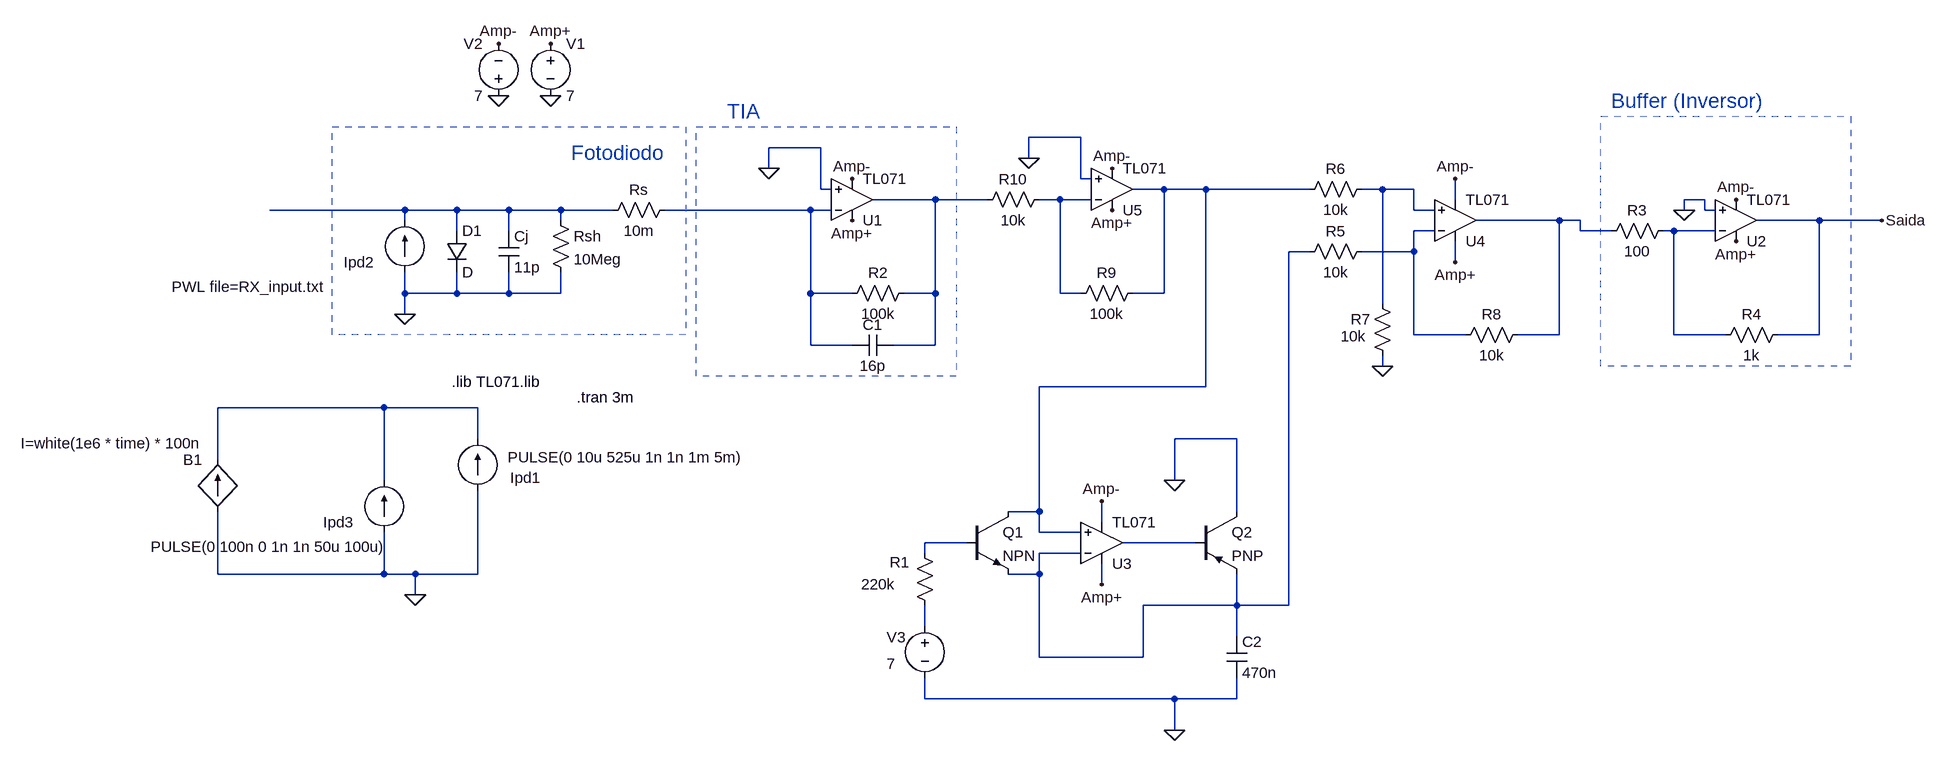
[diagram p0: schematic adaptative_receptor.asc]
adaptative_receptor.asc, the LTspice schematic file:
Version 4
SHEET 1 1100 900
WIRE -1440 -80 -1520 -80
WIRE -1840 -64 -1920 -64
WIRE -1520 -48 -1520 -80
WIRE -1920 -32 -1920 -64
WIRE -1440 -16 -1440 -80
WIRE -1424 -16 -1440 -16
WIRE -1840 0 -1840 -64
WIRE -1824 0 -1840 0
WIRE -1312 0 -1360 0
WIRE -1248 0 -1312 0
WIRE -1088 0 -1248 0
WIRE -976 0 -1008 0
WIRE -928 0 -976 0
WIRE -1664 16 -1760 16
WIRE -1584 16 -1664 16
WIRE -1472 16 -1504 16
WIRE -1424 16 -1472 16
WIRE -864 16 -864 -16
WIRE -480 16 -512 16
WIRE -2480 32 -2688 32
WIRE -2400 32 -2480 32
WIRE -2320 32 -2400 32
WIRE -2240 32 -2320 32
WIRE -2160 32 -2240 32
WIRE -1856 32 -2080 32
WIRE -1824 32 -1856 32
WIRE -928 32 -928 0
WIRE -896 32 -928 32
WIRE -512 32 -512 16
WIRE -480 32 -480 16
WIRE -464 32 -480 32
WIRE -2480 48 -2480 32
WIRE -2240 48 -2240 32
WIRE -704 48 -832 48
WIRE -672 48 -704 48
WIRE -304 48 -400 48
WIRE -208 48 -304 48
WIRE -2400 64 -2400 32
WIRE -2320 64 -2320 32
WIRE -896 64 -928 64
WIRE -672 64 -672 48
WIRE -624 64 -672 64
WIRE -528 64 -544 64
WIRE -464 64 -528 64
WIRE -1088 96 -1120 96
WIRE -928 96 -928 64
WIRE -928 96 -1008 96
WIRE -864 112 -864 80
WIRE -2480 160 -2480 128
WIRE -2400 160 -2400 128
WIRE -2400 160 -2480 160
WIRE -2320 160 -2320 128
WIRE -2320 160 -2400 160
WIRE -2240 160 -2240 128
WIRE -2240 160 -2320 160
WIRE -1856 160 -1856 32
WIRE -1792 160 -1856 160
WIRE -1664 160 -1664 16
WIRE -1664 160 -1712 160
WIRE -1472 160 -1472 16
WIRE -1440 160 -1472 160
WIRE -1312 160 -1312 0
WIRE -1312 160 -1360 160
WIRE -976 176 -976 0
WIRE -2480 192 -2480 160
WIRE -928 224 -928 96
WIRE -848 224 -928 224
WIRE -704 224 -704 48
WIRE -704 224 -768 224
WIRE -528 224 -528 64
WIRE -448 224 -528 224
WIRE -304 224 -304 48
WIRE -304 224 -368 224
WIRE -1856 240 -1856 160
WIRE -1792 240 -1856 240
WIRE -1664 240 -1664 160
WIRE -1664 240 -1728 240
WIRE -976 272 -976 256
WIRE -1248 304 -1248 0
WIRE -1248 304 -1504 304
WIRE -2512 336 -2768 336
WIRE -2368 336 -2512 336
WIRE -2368 384 -2368 336
WIRE -1200 384 -1296 384
WIRE -2768 416 -2768 336
WIRE -2512 448 -2512 336
WIRE -1296 448 -1296 384
WIRE -1504 496 -1504 304
WIRE -1504 496 -1552 496
WIRE -1200 496 -1200 384
WIRE -1408 512 -1408 480
WIRE -1504 528 -1504 496
WIRE -1440 528 -1504 528
WIRE -1616 544 -1680 544
WIRE -1264 544 -1376 544
WIRE -1680 560 -1680 544
WIRE -1440 560 -1504 560
WIRE -2768 592 -2768 496
WIRE -2512 592 -2512 528
WIRE -2512 592 -2768 592
WIRE -2464 592 -2512 592
WIRE -2368 592 -2368 464
WIRE -2368 592 -2464 592
WIRE -1504 592 -1504 560
WIRE -1504 592 -1552 592
WIRE -1408 608 -1408 576
WIRE -2464 624 -2464 592
WIRE -1200 640 -1200 592
WIRE -1200 640 -1344 640
WIRE -1120 640 -1120 96
WIRE -1120 640 -1200 640
WIRE -1680 672 -1680 640
WIRE -1200 688 -1200 640
WIRE -1504 720 -1504 592
WIRE -1344 720 -1344 640
WIRE -1344 720 -1504 720
WIRE -1680 784 -1680 752
WIRE -1296 784 -1680 784
WIRE -1200 784 -1200 752
WIRE -1200 784 -1296 784
WIRE -1296 832 -1296 784
FLAG -2256 -224 Amp+
FLAG -2256 -144 0
FLAG -2336 -224 Amp-
FLAG -2336 -144 0
FLAG -1792 48 Amp+
FLAG -1792 -16 Amp-
FLAG -1920 -32 0
FLAG -432 80 Amp+
FLAG -432 16 Amp-
FLAG -512 32 0
FLAG -2480 192 0
FLAG -1408 480 Amp-
FLAG -864 -16 Amp-
FLAG -1408 608 Amp+
FLAG -864 112 Amp+
FLAG -976 272 0
FLAG -1296 832 0
FLAG -1296 448 0
FLAG -2464 624 0
FLAG -208 48 Saida
FLAG -1392 32 Amp+
FLAG -1392 -32 Amp-
FLAG -1520 -48 0
SYMBOL OpAmps\\opamp2 -1792 80 M180
SYMATTR InstName U1
SYMATTR Value TL071
SYMBOL voltage -2256 -240 R0
WINDOW 123 0 0 Left 0
WINDOW 39 0 0 Left 0
SYMATTR InstName V1
SYMATTR Value 7
SYMBOL voltage -2336 -128 R180
WINDOW 0 24 96 Left 2
WINDOW 3 24 16 Left 2
WINDOW 123 0 0 Left 0
WINDOW 39 0 0 Left 0
SYMATTR InstName V2
SYMATTR Value 7
SYMBOL res -1696 144 R90
WINDOW 0 0 56 VBottom 2
WINDOW 3 32 56 VTop 2
SYMATTR InstName R2
SYMATTR Value 100k
SYMBOL res -528 48 R90
WINDOW 0 0 56 VBottom 2
WINDOW 3 32 56 VTop 2
SYMATTR InstName R3
SYMATTR Value 100
SYMBOL OpAmps\\opamp2 -432 112 M180
SYMATTR InstName U2
SYMATTR Value TL071
SYMBOL res -464 240 R270
WINDOW 0 32 56 VTop 2
WINDOW 3 0 56 VBottom 2
SYMATTR InstName R4
SYMATTR Value 1k
SYMBOL diode -2416 64 R0
SYMATTR InstName D1
SYMBOL cap -2336 64 R0
SYMATTR InstName Cj
SYMATTR Value 11p
SYMBOL res -2256 32 R0
SYMATTR InstName Rsh
SYMATTR Value 10Meg
SYMBOL res -2064 16 R90
WINDOW 0 0 56 VBottom 2
WINDOW 3 32 56 VTop 2
SYMATTR InstName Rs
SYMATTR Value 10m
SYMBOL cap -1728 224 R90
WINDOW 0 0 32 VBottom 2
WINDOW 3 32 32 VTop 2
SYMATTR InstName C1
SYMATTR Value 16p
SYMBOL npn -1616 496 R0
SYMATTR InstName Q1
SYMBOL pnp -1264 496 R0
SYMATTR InstName Q2
SYMBOL OpAmps\\opamp2 -1408 608 M180
SYMATTR InstName U3
SYMATTR Value TL071
SYMBOL cap -1216 688 R0
SYMATTR InstName C2
SYMATTR Value 470n
SYMBOL res -1696 544 R0
WINDOW 0 -38 30 Left 2
WINDOW 3 -82 64 Left 2
SYMATTR InstName R1
SYMATTR Value 220k
SYMBOL voltage -1680 656 R0
WINDOW 0 -59 33 Left 2
WINDOW 3 -59 74 Left 2
WINDOW 123 0 0 Left 0
WINDOW 39 0 0 Left 0
SYMATTR InstName V3
SYMATTR Value 7
SYMBOL OpAmps\\opamp2 -864 112 M180
SYMATTR InstName U4
SYMATTR Value TL071
SYMBOL res -1104 112 R270
WINDOW 0 32 56 VTop 2
WINDOW 3 0 56 VBottom 2
SYMATTR InstName R5
SYMATTR Value 10k
SYMBOL res -1104 16 R270
WINDOW 0 32 56 VTop 2
WINDOW 3 0 56 VBottom 2
SYMATTR InstName R6
SYMATTR Value 10k
SYMBOL res -992 160 R0
WINDOW 0 -33 40 Left 2
WINDOW 3 -48 66 Left 2
SYMATTR InstName R7
SYMATTR Value 10k
SYMBOL res -752 208 R90
WINDOW 0 0 56 VBottom 2
WINDOW 3 32 56 VTop 2
SYMATTR InstName R8
SYMATTR Value 10k
SYMBOL current -2512 528 R180
WINDOW 3 359 -22 Right 2
WINDOW 123 0 0 Left 0
WINDOW 39 0 0 Left 0
WINDOW 0 94 16 Right 2
SYMATTR Value PULSE(0 100n 0 1n 1n 50u 100u)
SYMATTR InstName Ipd3
SYMBOL current -2368 464 R180
WINDOW 3 -46 52 Right 2
WINDOW 123 0 0 Left 0
WINDOW 39 0 0 Left 0
WINDOW 0 -50 20 Right 2
SYMATTR Value PULSE(0 10u 525u 1n 1n 1m 5m)
SYMATTR InstName Ipd1
SYMBOL bi -2768 496 R180
WINDOW 0 24 80 Left 2
WINDOW 3 24 105 Left 2
SYMATTR InstName B1
SYMATTR Value I=white(1e6 * time) * 100n
SYMBOL OpAmps\\opamp2 -1392 64 M180
SYMATTR InstName U5
SYMATTR Value TL071
SYMBOL res -1344 144 R90
WINDOW 0 0 56 VBottom 2
WINDOW 3 32 56 VTop 2
SYMATTR InstName R9
SYMATTR Value 100k
SYMBOL res -1488 0 R90
WINDOW 0 0 56 VBottom 2
WINDOW 3 32 56 VTop 2
SYMATTR InstName R10
SYMATTR Value 10k
SYMBOL current -2480 128 R180
WINDOW 3 359 -22 Right 2
WINDOW 123 0 0 Left 0
WINDOW 39 0 0 Left 0
WINDOW 0 94 16 Right 2
SYMATTR Value PWL file=RX_input.txt
SYMATTR InstName Ipd2
TEXT -2408 296 Left 2 !.lib TL071.lib
TEXT -2224 -56 Left 3 ;Fotodiodo
TEXT -1984 -120 Left 3 ;TIA
TEXT -624 -136 Left 3 ;Buffer (Inversor)
TEXT -2216 320 Left 2 !.tran 3m
RECTANGLE Normal -1632 288 -2032 -96 2
RECTANGLE Normal -256 272 -640 -112 2
RECTANGLE Normal -2048 224 -2592 -96 2

The netlist it stands for:
* adaptative_receptor.asc
XU1 0 N006 Amp+ Amp- N003 TL071  ; pins In+ In- V+ V- OUT
V1 Amp+ 0 7
V2 0 Amp- 7
R2 N003 N006 100k
R3 N009 N007 100
XU2 0 N009 Amp+ Amp- Saida TL071  ; pins In+ In- V+ V- OUT
R4 N009 Saida 1k
D1 N005 0 D
Cj N005 0 11p
Rsh N005 0 10Meg
Rs N006 N005 10m
C1 N003 N006 16p
Q1 N001 N012 N010 0 NPN
Q2 0 N013 N010 0 PNP
XU3 N001 N010 Amp+ Amp- N013 TL071  ; pins In+ In- V+ V- OUT
C2 N010 0 470n
R1 N012 N014 220k
V3 N014 0 7
XU4 N002 N008 Amp+ Amp- N007 TL071  ; pins In+ In- V+ V- OUT
R5 N010 N008 10k
R6 N001 N002 10k
R7 N002 0 10k
R8 N007 N008 10k
Ipd3 0 N011 PULSE(0 100n 0 1n 1n 50u 100u)
Ipd1 0 N011 PULSE(0 10u 525u 1n 1n 1m 5m)
B1 0 N011 I=white(1e6 * time) * 100n
XU5 0 N004 Amp+ Amp- N001 TL071  ; pins In+ In- V+ V- OUT
R9 N001 N004 100k
R10 N004 N003 10k
Ipd2 0 N005 PWL file=RX_input.txt
.model D D
.lib standard.dio
.model NPN NPN
.model PNP PNP
.lib standard.bjt
.lib TL071.lib
* Fotodiodo
* TIA
* Buffer (Inversor)
.tran 3m
.backanno
.end